# EasyEDA Pro project easyeda.epro

# Schematic Schematic1
Board Name: Board1; Create Date: 2025-08-13; Page Name: P1; Project Name: bop - audio over bluetooth; Schematic Name: Schematic1; Update Date: 2025-08-18; Company: EasyEDA.com; Page Size: A4; Version: V1.0
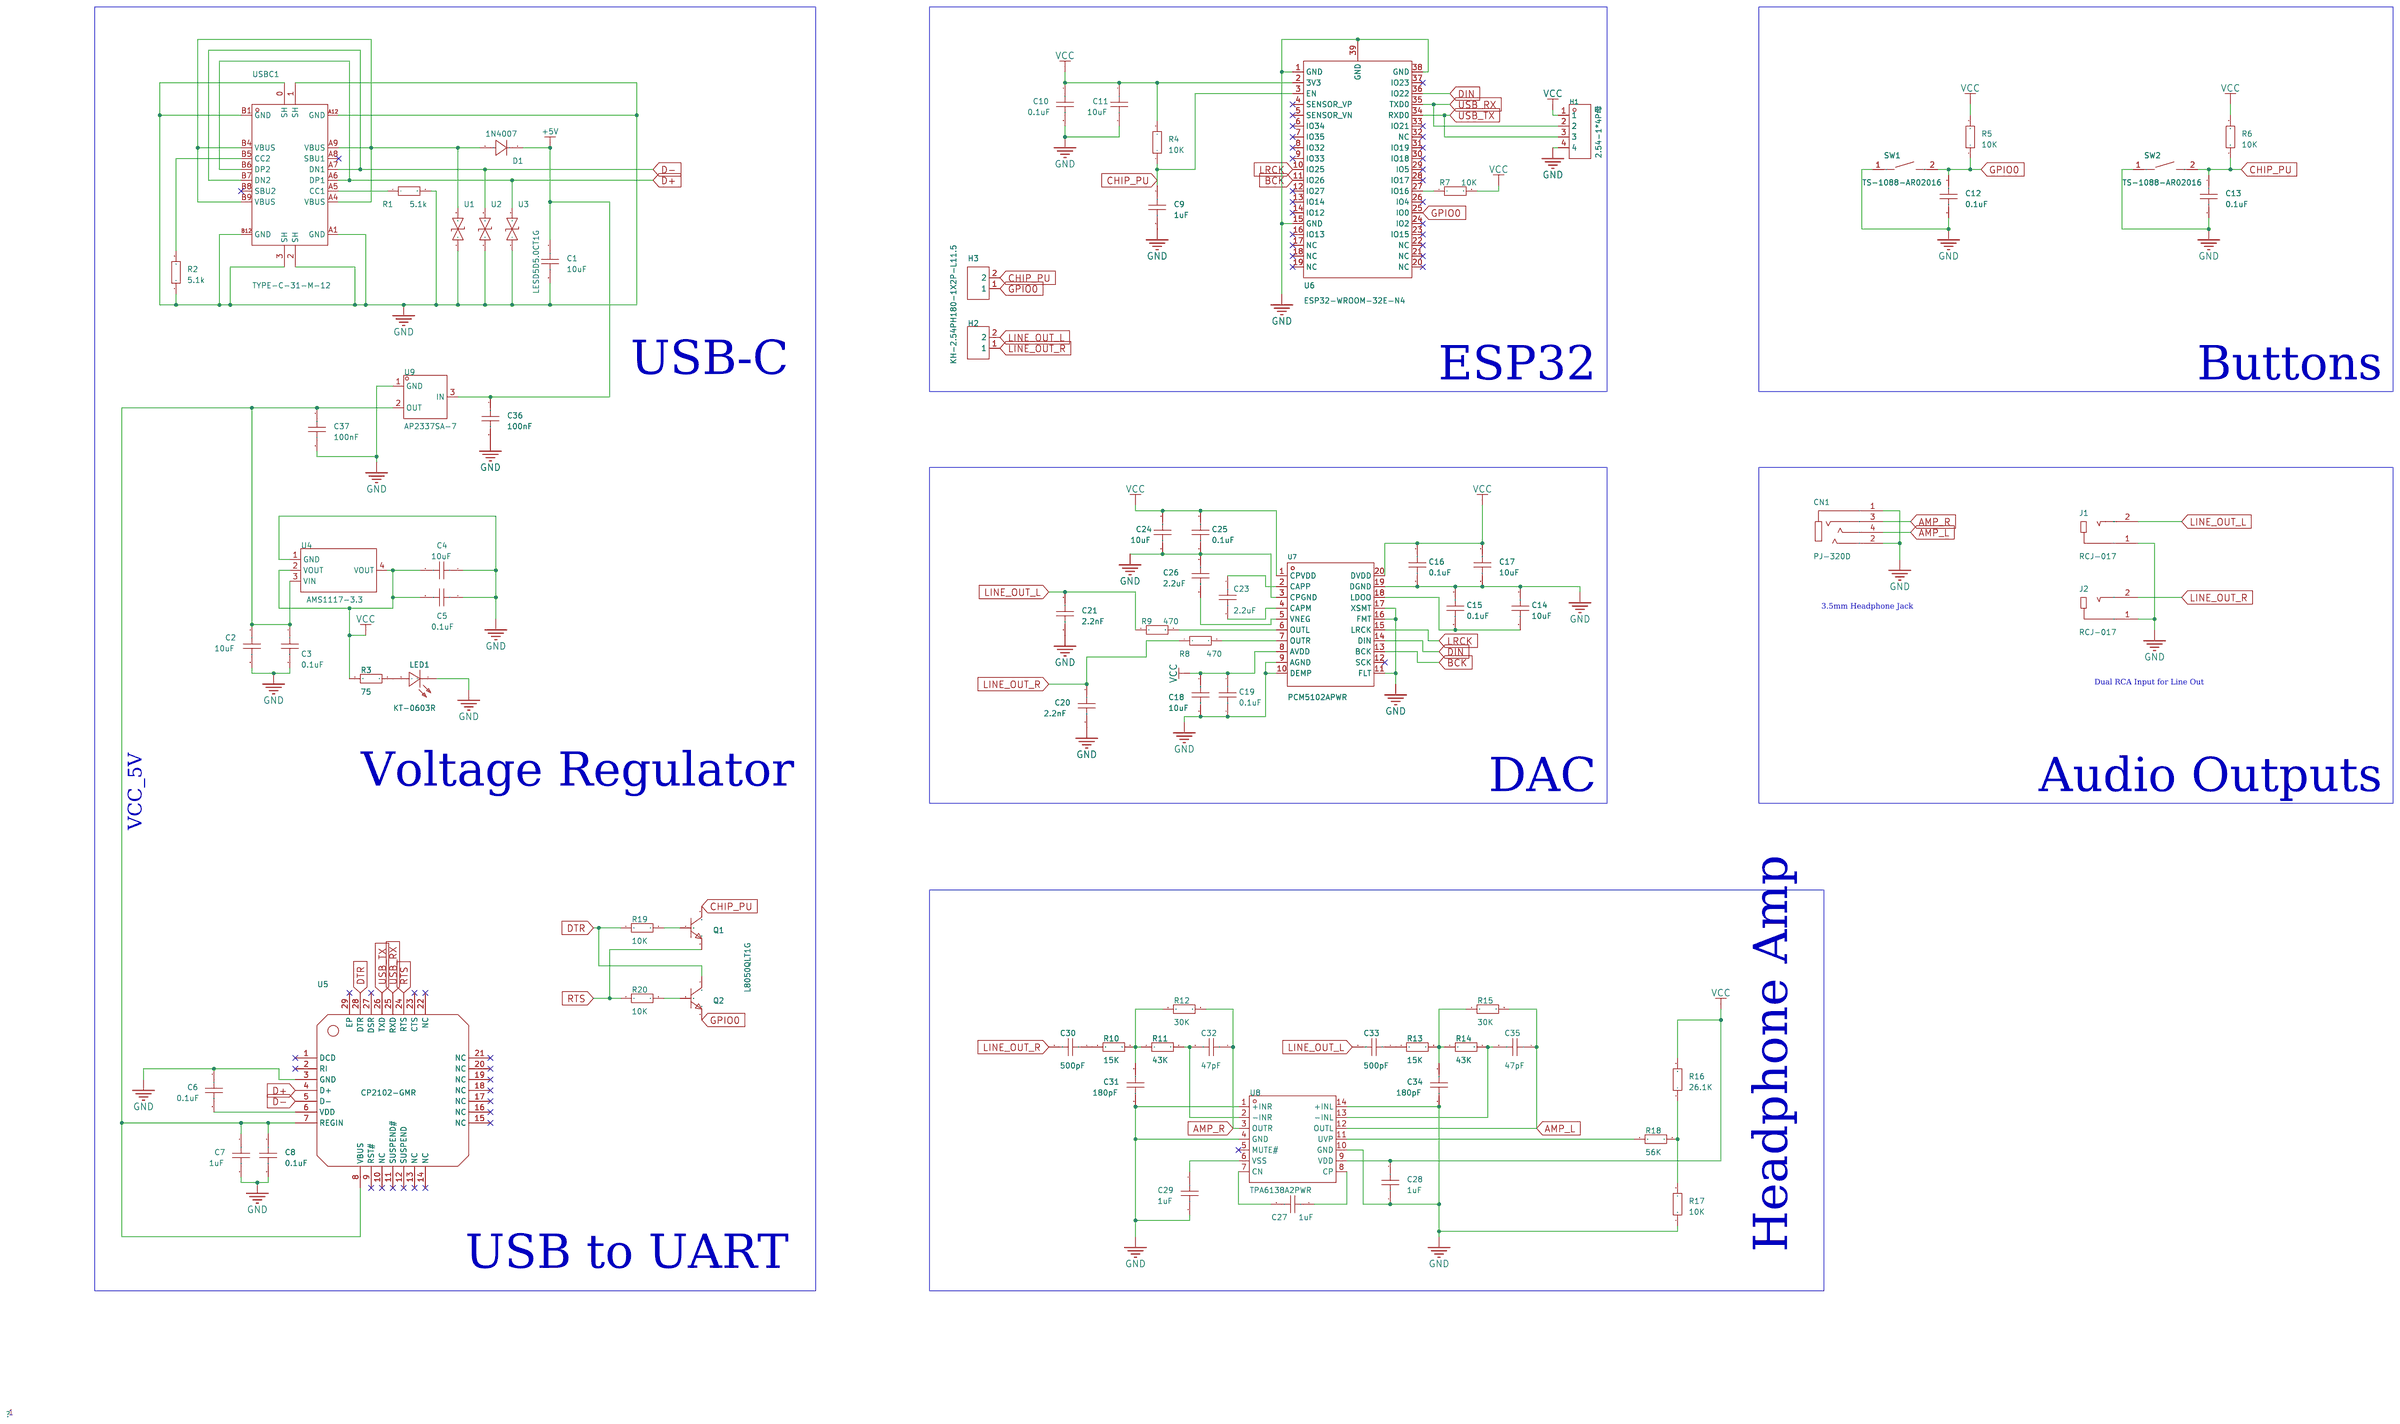
[diagram p0: schematic sheet]

## Parts
C1  10uF  [C0603]
C2  10uF  [C0603]
C3  0.1uF  [C0603]
C4  10uF  [C0603]
C5  0.1uF  [C0603]
C6  0.1uF  [C0603]
C7  1uF  [C0603]
C8  0.1uF  [C0603]
C9  1uF  [C0603]
C10  0.1uF  [C0603]
C11  10uF  [C0603]
C12  0.1uF  [C0603]
C13  0.1uF  [C0603]
C14  10uF  [C0603]
C15  0.1uF  [C0603]
C16  0.1uF  [C0603]
C17  10uF  [C0603]
C18  10uF  [C0603]
C19  0.1uF  [C0603]
C20  2.2nF  [C0603]
C21  2.2nF  [C0603]
C23  2.2uF  [C0603]
C24  10uF  [C0603]
C25  0.1uF  [C0603]
C26  2.2uF  [C0603]
C27  1uF  [C0603]
C28  1uF  [C0603]
C29  1uF  [C0603]
C30  500pF  [C0603]
C31  180pF  [C0603]
C32  47pF  [C0603]
C33  500pF  [C0603]
C34  180pF  [C0603]
C35  47pF  [C0603]
C36  100nF  [C0603]
C37  100nF  [C0603]
CN1  PJ-320D  [AUDIO-SMD_PJ-320D]
D1  1N4007  [SMA_L4.3-W2.5-LS5.0-RD]
H1  2.54-1*4P母  [HDR-TH_4P-P2.54-V-F]
H2  KH-2.54PH180-1X2P-L11.5  [HDR-TH_2P-P2.54-V-M]
H3  KH-2.54PH180-1X2P-L11.5  [HDR-TH_2P-P2.54-V-M]
J1  RCJ-017  [CONN-TH_RCJ-013]
J2  RCJ-017  [CONN-TH_RCJ-013]
LED1  KT-0603R  [LED0603-RD]
Q1  L8050QLT1G  [SOT-23-3_L2.9-W1.3-P1.90-LS2.4-BR]
Q2  L8050QLT1G  [SOT-23-3_L2.9-W1.3-P1.90-LS2.4-BR]
R1  5.1k  [R0603]
R2  5.1k  [R0603]
R3  75  [R0603]
R4  10K  [R0603]
R5  10K  [R0603]
R6  10K  [R0603]
R7  10K  [R0603]
R8  470  [R0603]
R9  470  [R0603]
R10  15K  [R0603]
R11  43K  [R0603]
R12  30K  [R0603]
R13  15K  [R0603]
R14  43K  [R0603]
R15  30K  [R0603]
R16  26.1K  [R0603]
R17  10K  [R0603]
R18  56K  [R0603]
R19  10K  [R0603]
R20  10K  [R0603]
SW1  TS-1088-AR02016  [SW-SMD_L3.9-W3.0-P4.45]
SW2  TS-1088-AR02016  [SW-SMD_L3.9-W3.0-P4.45]
U1  LESD5D5.0CT1G  [SOD-523_L1.2-W0.8-LS1.6-BI]
U2  LESD5D5.0CT1G  [SOD-523_L1.2-W0.8-LS1.6-BI]
U3  LESD5D5.0CT1G  [SOD-523_L1.2-W0.8-LS1.6-BI]
U4  AMS1117-3.3  [SOT-223-3_L6.5-W3.4-P2.30-LS7.0-BR]
U5  CP2102-GMR  [WQFN-28_L5.0-W5.0-P0.50-BL-EP3.2]
U6  ESP32-WROOM-32E-N4  [WIFI-SMD_ESP32-WROOM-32E]
U7  PCM5102APWR  [TSSOP-20_L6.5-W4.4-P0.65-LS6.4-BL]
U8  TPA6138A2PWR  [TSSOP-14_L5.0-W4.4-P0.65-LS6.4-BL]
U9  AP2337SA-7  [SOT-23-3_L2.9-W1.3-P1.90-LS2.4-BR]
USBC1  TYPE-C-31-M-12  [USB-C_SMD-TYPE-C-31-M-12]

## Library data of the parts
C1-C21 C23-C37 = CAP_0603: Supplier Footprint: 0603
CN1 = PJ-320D_C521460: Connector Type:3.5mm耳机座 Current Rating (Max):1A Voltage Rating (Max):30V Operating Temperature Range:- Operating Temperature Range:-; LCSC Part Name: 3.5mm耳机座; Supplier Part: C521460; Manufacturer: USAKRO(美韩); Supplier Footprint: SMD; JLCPCB Part Class: Extended Part; Datasheet: https://atta.szlcsc.com/upload/public/pdf/source/20200424/C521460_2B00C929BFB12DD9A87BCC02E8D00E32.pdf; Supplier: LCSC; Connector Type: 3.5mm耳机座; Current Rating (Max): 1A; Voltage Rating (Max): 30V
D1 = 1N4007_C727081: Diode Configuration:Independent Voltage - Forward(Vf@If):1.1V@1A Voltage - DC Reverse(Vr):1kV Current - Rectified:1A Reverse Leakage Current (Ir):5uA; Supplier Part: C727081; Manufacturer: TWGMC(台湾迪嘉); Supplier Footprint: SMA(DO-214AC); JLCPCB Part Class: Extended Part; Datasheet: https://item.szlcsc.com/datasheet/1N4007/774186.html; Supplier: LCSC; Diode Configuration: Independent; Voltage - Forward(Vf@If): 1.1V@1A; Voltage - DC Reverse(Vr): 1kV; Current - Rectified: 1A; Reverse Leakage Current (Ir): 5uA
H1 = 2.54-1*4P母: Holes Structure:1x4P Pitch:2.54mm Row Spacing:- Circular Hole / Square Hole:Square Holes Mounting Type:Straight Number of Rows:Plugin Number of Holes:4P Current Rating (Max):3A Voltage Rating (Max):- Holes Direction:Top Insulation Height:- Contact Materia; LCSC Part Name: 间距:2.54mm 1x4P 直插; Supplier Part: C2718488; Manufacturer: BOOMELE(博穆精密); Supplier Footprint: 插件,P=2.54mm; JLCPCB Part Class: Extended Part; Datasheet: https://atta.szlcsc.com/upload/public/pdf/source/20210301/C2718488_F4427B881E42CAA8DDB0B1C12B3A522C.pdf; Supplier: LCSC; Holes Structure: 1x4P; Pitch: 2.54mm; Circular Hole / Square Hole: Square Holes; Mounting Type: Straight; Number of Rows: Plugin; Number of Holes: 4P; Current Rating (Max): 3A; Holes Direction: Top; Contact Material: bronze; Operating Temperature Range: -40℃~+105℃
H2 H3 = KH-2.54PH180-1X2P-L11.5: Pin Structure:1x2P Pitch:2.54mm Row Spacing:- Circluar Pins/Square Pins:Policy Mounting Type:Straight Number of Rows:Single Row Number of Pins:2P Current Rating:3A Voltage Rating (Max):- Length of Mating Pin:6mm Insulation Height:2.5mm Length of End Conne; LCSC Part Name: 1x2P 间距:2.54mm 方针 直插; Supplier Part: C2905434; Manufacturer: kinghelm(金航标); Supplier Footprint: 插件,P=2.54mm; JLCPCB Part Class: Extended Part; Datasheet: https://atta.szlcsc.com/upload/public/pdf/source/20211019/75EAF9E0823F75B5BB441C07BAE9F5E6.pdf; Supplier: LCSC; Pin Structure: 1x2P; Pitch: 2.54mm; Circluar Pins/Square Pins: Policy; Mounting Type: Straight; Number of Rows: Single Row; Number of Pins: 2P; Current Rating: 3A; Length of Mating Pin: 6mm; Insulation Height: 2.5mm; Length of End Connection Pin: 3mm; Operating Temperature: -40℃~+105℃; Color: Black
J1 J2 = RCJ-017: Supplier Part: C22359757; Manufacturer: CUI; JLCPCB Part Class: Extended Part; Datasheet: https://item.szlcsc.com/datasheet/RCJ-017/23802230.html; Supplier: LCSC
LED1 = KT-0603R: Emitted Color:Red Power Dissipation:- Forward Current:- Dominant Wavelength:- Dominant Wavelength:- Peak Wavelength:- Diode Configuration:- Lens Color:- Color Temperature:- Color Temperature:- Viewing Angle:- Mounting Sytle:- Operating Temperature:-40℃~+8; LCSC Part Name: 0603 红灯 高亮; Supplier Part: C2286; Manufacturer: KENTO; Supplier Footprint: 0603; JLCPCB Part Class: Basic Part; Datasheet: https://atta.szlcsc.com/upload/public/pdf/source/20160616/1466072038404.pdf; Supplier: LCSC; Emitted Color: Red; Operating Temperature: -40℃~+85℃
Q1 Q2 = L8050QLT1G: Transistor Type: Collector Current (Ic): Collector-Emitter Breakdown Voltage (Vceo): Power Dissipation (Pd): DC Current Gain (hFE@Ic,Vce):100@100mA,1V DC Current Gain (hFE@Ic,Vce):100@100mA,1V Collector Cut-Off Current (Icbo):150nA Collector-Emitter Satur; LCSC Part Name: NPN 电流:800mA 耐压:25V; Supplier Part: C49581; Manufacturer: LRC(乐山无线电); Supplier Footprint: SOT-23; JLCPCB Part Class: Extended Part; Datasheet: https://atta.szlcsc.com/upload/public/pdf/source/20150518/1457707314424.pdf; Supplier: LCSC; DC Current Gain (hFE@Ic,Vce): 100@100mA,1V; Collector Cut-Off Current (Icbo): 150nA; Collector-Emitter Saturation Voltage (VCE(sat)@Ic,Ib): 500mV@800mA,80mA; Operating Temperature: -55℃~+150℃
R1-R20 = Res_0603: Supplier Footprint: 0603
SW1 SW2 = TS-1088-AR02016: Circuit:SPST Actuator Style:Round Button Operating Force:160gf Mounting Style:Brick nogging Switch Length:4mm Switch Width:3mm Switch Height:2mm Strike Gundam:不带 Contact Current:50mA Voltage Rating (DC):12V Insulation Resistance:100MΩ Actuator/Cap Color:B; LCSC Part Name: 4*3*2mm 立贴 轻触开关; Supplier Part: C720477; Manufacturer: XUNPU(讯普); Supplier Footprint: SMD; JLCPCB Part Class: Basic Part; Datasheet: https://atta.szlcsc.com/upload/public/pdf/source/20200810/C720475_60D09DD6C54279ADDB2DC25100F1CC11.pdf; Supplier: LCSC; Circuit: SPST; Actuator Style: Round Button; Operating Force: 160gf; Mounting Style: Brick nogging; Switch Length: 4mm; Switch Width: 3mm; Switch Height: 2mm; Strike Gundam: 不带; Contact Current: 50mA; Voltage Rating (DC): 12V; Insulation Resistance: 100MΩ; Actuator/Cap Color: Black; Pin Style: SMDSplicing; Mechanical Life: 10万次; Operating Temperature: -30℃~+80℃
U1-U3 = LESD5D5.0CT1G_C5246195: Supplier Part: C5246195; Manufacturer: Leiditech(雷卯电子); Supplier Footprint: SOD-523; JLCPCB Part Class: Extended Part; Datasheet: https://atta.szlcsc.com/upload/public/pdf/source/20221108/1C42B36F7D16189BC2911DA9C8277455.pdf; Supplier: LCSC
U4 = AMS1117-3.3_C6186: Output Type:Fixed Voltage - Supply:16V Output Voltage:3.3V Output Voltage:3.3V Output Current:1A Power Supply Rejection Ratio (PSRR):72dB@(120Hz) Voltage Dropout:1.1V@(800mA) standby current:5mA Noise:- Features:Over Current Protection；Over Temperature Pr; LCSC Part Name: 输出3.3V 1A; Supplier Part: C6186; Manufacturer: AMS; Supplier Footprint: SOT-223; JLCPCB Part Class: Basic Part; Datasheet: https://item.szlcsc.com/datasheet/AMS1117-3.3/6652.html; Supplier: LCSC; Output Type: Fixed; Voltage - Supply: 16V; Output Voltage: 3.3V; Output Current: 1A; Power Supply Rejection Ratio (PSRR): 72dB@(120Hz); Voltage Dropout: 1.1V@(800mA); standby current: 5mA; Features: Over Current Protection；Over Temperature Protection; Operating Temperature: -40℃~+125℃; Output Configuration: Positive; Number of Outputs: 1
U5 = CP2102-GMR: Applications Function:Transceiver Protocol: Number of Channels:- Supply Voltage:3V~3.6V Supply Voltage:3V~3.6V Data Rate:12Mbps Operating Temperature:- Operating Temperature:-; LCSC Part Name: 单芯片USB转UART桥接器; Supplier Part: C6568; Manufacturer: SKYWORKS/SILICON LABS(芯科); Supplier Footprint: WQFN-28-EP(5x5); JLCPCB Part Class: Extended Part; Datasheet: https://atta.szlcsc.com/upload/public/pdf/source/20170103/1483439882795.pdf; Supplier: LCSC; Applications Function: Transceiver; Supply Voltage: 3V~3.6V; Data Rate: 12Mbps
U6 = ESP32-WROOM-32E-N4: LCSC Part Name: 通用型Wi-Fi+BT+BLE MCU模组; Supplier Part: C701341; Manufacturer: ESPRESSIF(乐鑫); Supplier Footprint: SMD,18x25.5mm; JLCPCB Part Class: Extended Part; Datasheet: https://atta.szlcsc.com/upload/public/pdf/source/20241030/447B1C85FFE3FB0A37F75624F2C6635F.pdf; Supplier: LCSC
U7 = PCM5102APWR: Interface Type:PCM Supply Voltage:1.65V~3.46V Supply Voltage:1.65V~3.46V Number of Channels:2 Resolution:24；16；32 Operating Temperature:-25℃~+85℃ Operating Temperature:-25℃~+85℃; Supplier Part: C107671; Manufacturer: TI(德州仪器); Supplier Footprint: TSSOP-20; JLCPCB Part Class: Extended Part; Datasheet: https://www.ti.com/cn/lit/gpn/pcm5102a; Supplier: LCSC; Interface Type: PCM; Supply Voltage: 1.65V~3.46V; Number of Channels: 2; Resolution: 24；16；32; Operating Temperature: -25℃~+85℃
U8 = TPA6138A2PWR: Class:Class AB Speaker Channels:2-Channel Output Power:40mWx2@32Ω Voltage - Supply:3V~3.6V Voltage - Supply:3V~3.6V Total Harmonic Distortion + Noise (THD+N):0.01% Quiescent Current:14mA Operating Temperature:-40℃~+85℃ Operating Temperature:-40℃~+85℃ Sign; LCSC Part Name: 具有可调增益的立体声耳机驱动器; Supplier Part: C183097; Manufacturer: TI(德州仪器); Supplier Footprint: TSSOP-14; JLCPCB Part Class: Extended Part; Datasheet: https://www.ti.com/cn/lit/gpn/tpa6138a2; Supplier: LCSC; Class: Class AB; Speaker Channels: 2-Channel; Output Power: 40mWx2@32Ω; Voltage - Supply: 3V~3.6V; Total Harmonic Distortion + Noise (THD+N): 0.01%; Quiescent Current: 14mA; Operating Temperature: -40℃~+85℃; Signal-to-Noise Ratio: 96dB; Input Type: Differential; Power Supply Rejection Ratio (PSRR): 80dB; Number of Inputs: 2对差分输入
U9 = AP2337SA-7: Type:Load Switch Number of Channels:1 Control Input Logic:- Maximum Continuous Current:1A Voltage - Supply:2.7V~5.5V Voltage - Supply:2.7V~5.5V RDS(on):110mΩ Operating Temperature	-:-40℃~+85℃ Operating Temperature	-:-40℃~+85℃; Supplier Part: C150497; Manufacturer: DIODES(美台); Supplier Footprint: SOT-23; JLCPCB Part Class: Extended Part; Datasheet: https://item.szlcsc.com/datasheet/AP2337SA-7/161835.html; Supplier: LCSC; Type: Load Switch; Number of Channels: 1; Maximum Continuous Current: 1A; Voltage - Supply: 2.7V~5.5V; RDS(on): 110mΩ; Operating Temperature	-: -40℃~+85℃
USBC1 = TYPE-C-31-M-12: Connector Type:Type-C Standard:- Gender:Female Mounting Style:- Number of Contacts:16P Number of Ports:1 Current Rating - Power (Max):5A Operating Temperature Range:- Operating Temperature Range:-; LCSC Part Name: Type-C 母; Supplier Part: C165948; Manufacturer: 韩国韩荣; Supplier Footprint: SMD; JLCPCB Part Class: Extended Part; Datasheet: https://atta.szlcsc.com/upload/public/pdf/source/20220525/466408E853115E789EDB0DDC29077C05.pdf; Supplier: LCSC; Connector Type: Type-C; Gender: Female; Number of Contacts: 16P; Number of Ports: 1; Current Rating - Power (Max): 5A

## Nets
+5V: C1.1 C36.1 D1.1(K) U9.3(IN)
GND: C1.2 C2.2 C3.2 C4.1 C5.1 C6.1 C7.2 C8.2 C9.2 C10.2 C11.2 C12.2 C13.2 C14.1 C15.1 C16.2 C17.2 C18.2 C19.2 C20.2 C21.2 C24.2 C25.2 C26.1 C28.2 C29.2 C31.2 C34.2 C36.2 C37.2 CN1.1 CN1.2 H1.4 J1.1 J2.1 LED1.1(K) R1.2 R2.1 R17.1 SW1.1 SW2.1 U1.1 U2.1 U3.1 U4.1(GND) U5.3(GND) U6.1(GND) U6.15(GND) U6.38(GND) U6.39(GND) U7.3(CPGND) U7.9(AGND) U7.10(DEMP) U7.11(FLT) U7.16(FMT) U7.17(XSMT) U7.19(DGND) U8.1(+INR) U8.4(GND) U8.10(GND) U8.14(+INL) U9.1(GND) USBC1.0(SH) USBC1.1(SH) USBC1.2(SH) USBC1.3(SH) USBC1.A1(GND) USBC1.A12(GND) USBC1.B1(GND) USBC1.B12(GND)
VCC: C4.2 C5.2 C10.1 C11.1 C16.1 C17.1 C18.1 C19.1 C24.1 C25.1 C28.1 H1.1 R3.2 R4.2 R5.2 R6.2 R7.2 R16.2 U4.2(VOUT) U4.4(VOUT) U6.2(3V3) U7.1(CPVDD) U7.8(AVDD) U7.20(DVDD) U8.9(VDD)
AMP_L: C35.1 CN1.4 R15.2 U8.12(OUTL)
AMP_R: C32.1 CN1.3 R12.2 U8.3(OUTR)
BCK: U6.11(IO26) U7.13(BCK)
CHIP_PU: C9.1 C13.1 H3.2 Q1.3(C) R4.1 R6.1 SW2.2 U6.3(EN)
D+: U3.2 U5.4(D+) USBC1.A6(DP1) USBC1.B6(DP2)
D-: U2.2 U5.5(D-) USBC1.A7(DN1) USBC1.B7(DN2)
DIN: U6.36(IO22) U7.14(DIN)
DTR: Q2.3(C) R19.1 U5.28(DTR)
GPIO0: C12.1 H3.1 Q2.2(E) R5.1 SW1.2 U6.25(IO0)
LINE_OUT_L: C21.1 C33.2 H2.2 J1.2 R9.1
LINE_OUT_R: C20.1 C30.2 H2.1 J2.2 R8.1
LRCK: U6.10(IO25) U7.15(LRCK)
RTS: Q1.2(E) R20.1 U5.24(RTS)
USB_RX: H1.2 U5.25(RXD) U6.35(TXD0)
USB_TX: H1.3 U5.26(TXD) U6.34(RXD0)
$1N698: R1.1 USBC1.A5(CC1)
$1N818: R2.2 USBC1.B5(CC2)
$1N1017: D1.2(A) U1.2 USBC1.A4(VBUS) USBC1.A9(VBUS) USBC1.B4(VBUS) USBC1.B9(VBUS)
$1N2185: LED1.2(A) R3.1
$1N2543: C6.2 U5.6(VDD)
$1N4373: R7.1 U6.27(IO16)
$1N4719: C14.2 C15.2 U7.18(LDOO)
$1N5077: R8.2 U7.7(OUTR)
$1N5228: R9.2 U7.6(OUTL)
$1N5429: C23.2 U7.4(CAPM)
$1N5435: C23.1 U7.2(CAPP)
$1N5672: C26.2 U7.5(VNEG)
$1N6006: C27.2 U8.7(CN)
$1N6011: C27.1 U8.8(CP)
$1N6223: C29.1 U8.6(VSS)
$1N6630: C30.1 R10.1
$1N6710: C31.1 R10.2 R11.1 R12.1
$1N6768: C32.2 R11.2 U8.2(-INR)
$1N7245: C33.1 R13.1
$1N7247: C34.1 R13.2 R14.1 R15.1
$1N7639: R18.1 U8.11(UVP)
$1N7645: R16.1 R17.2 R18.2
$1N7658: C35.2 R14.2 U8.13(-INL)
$1N19592: C2.1 C3.1 C7.1 C8.1 C37.1 U4.3(VIN) U5.7(REGIN) U5.8(VBUS) U9.2(OUT)
$1N20296: Q1.1(B) R19.2
$1N20339: Q2.1(B) R20.2

Not connected (* = marked no-connect by the designer): U5 1(DCD)* 2(RI)* 9(RST#)* 10(NC)* 11(SUSPEND#)* 12(SUSPEND)* 13(NC)* 14(NC)* 15(NC)* 16(NC)* 17(NC)* 18(NC)* 19(NC)* 20(NC)* 21(NC)* 22(NC)* 23(CTS)* 27(DSR)* 29(EP)*; U6 4(SENSOR_VP)* 5(SENSOR_VN)* 6(IO34)* 7(IO35)* 8(IO32)* 9(IO33)* 12(IO27)* 13(IO14)* 14(IO12)* 16(IO13)* 17(NC)* 18(NC)* 19(NC)* 20(NC)* 21(NC)* 22(NC)* 23(IO15)* 24(IO2)* 26(IO4)* 28(IO17)* 29(IO5)* 30(IO18)* 31(IO19)* 32(NC)* 33(IO21)* 37(IO23)*; U7 12(SCK)*; U8 5(MUTE#)*; USBC1 A8(SBU1)* B8(SBU2)*

## Notes on the sheet
- USB-C
- ESP32
- Buttons
- 3.5mm Headphone Jack
- Dual RCA Input for Line Out
- VCC_5V
- Voltage Regulator
- DAC
- Audio Outputs
- Headphone Amp
- USB to UART

# Board PCB1
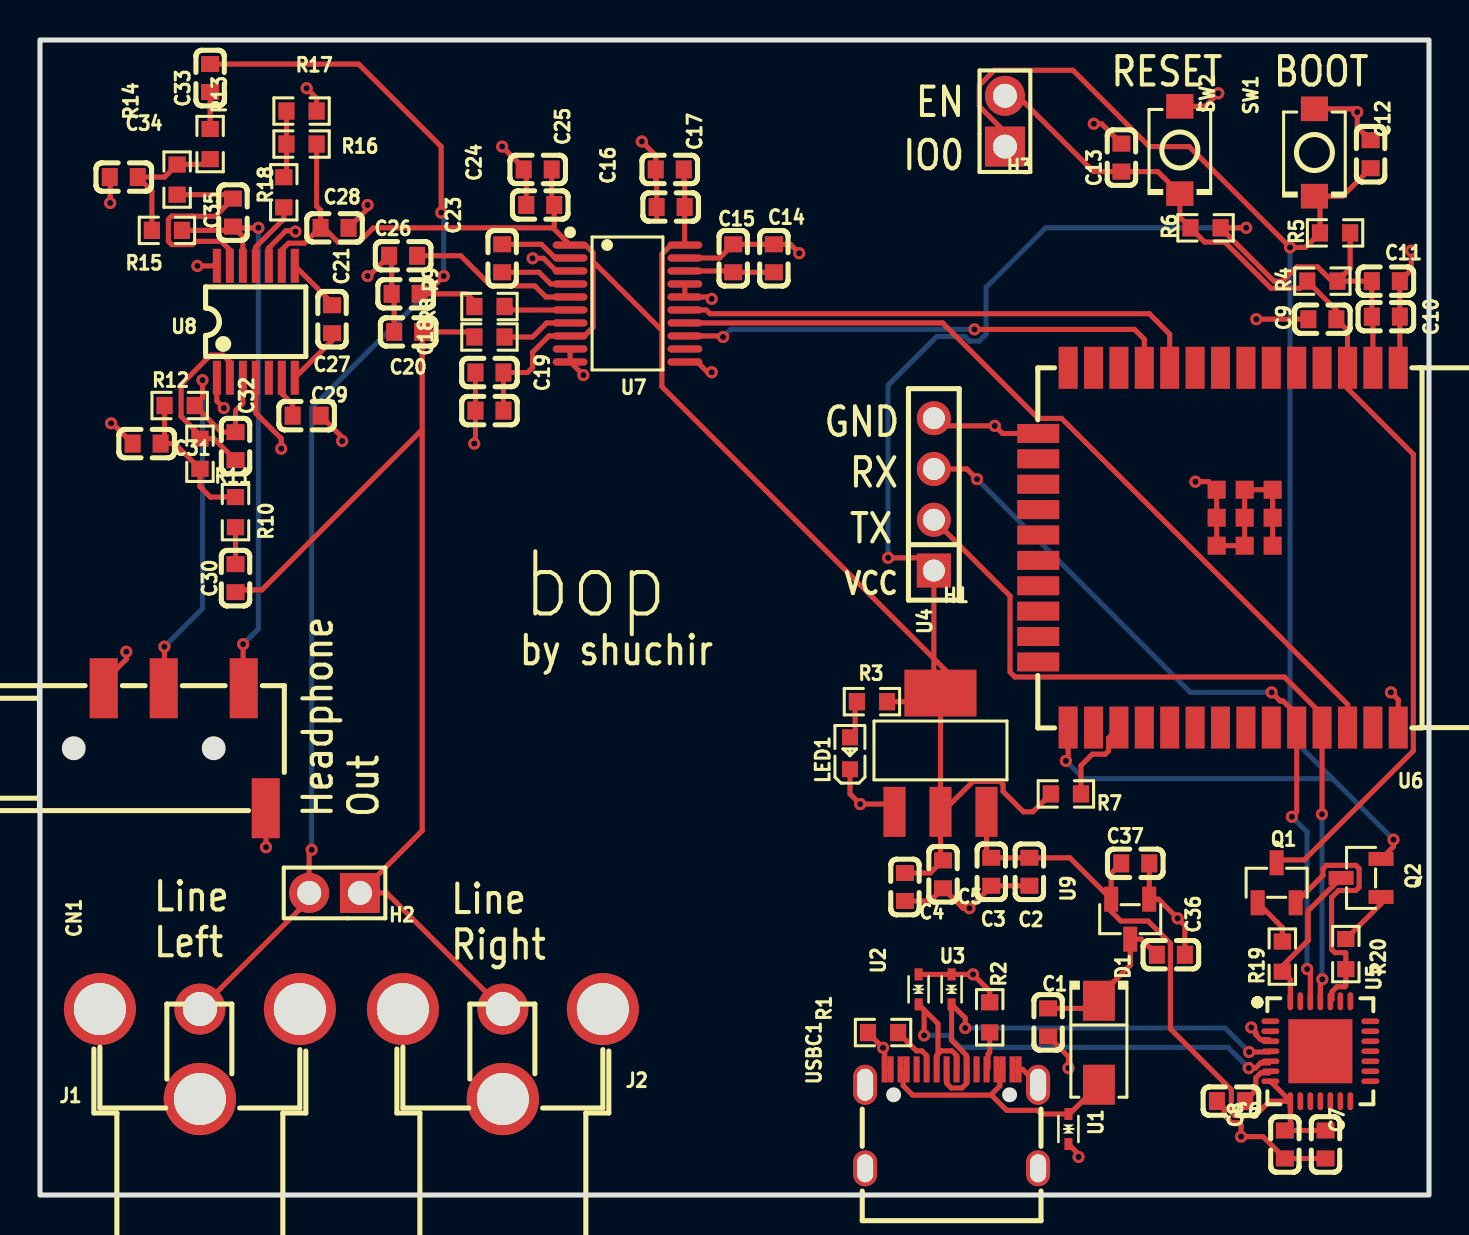
[diagram p1: board, top side]
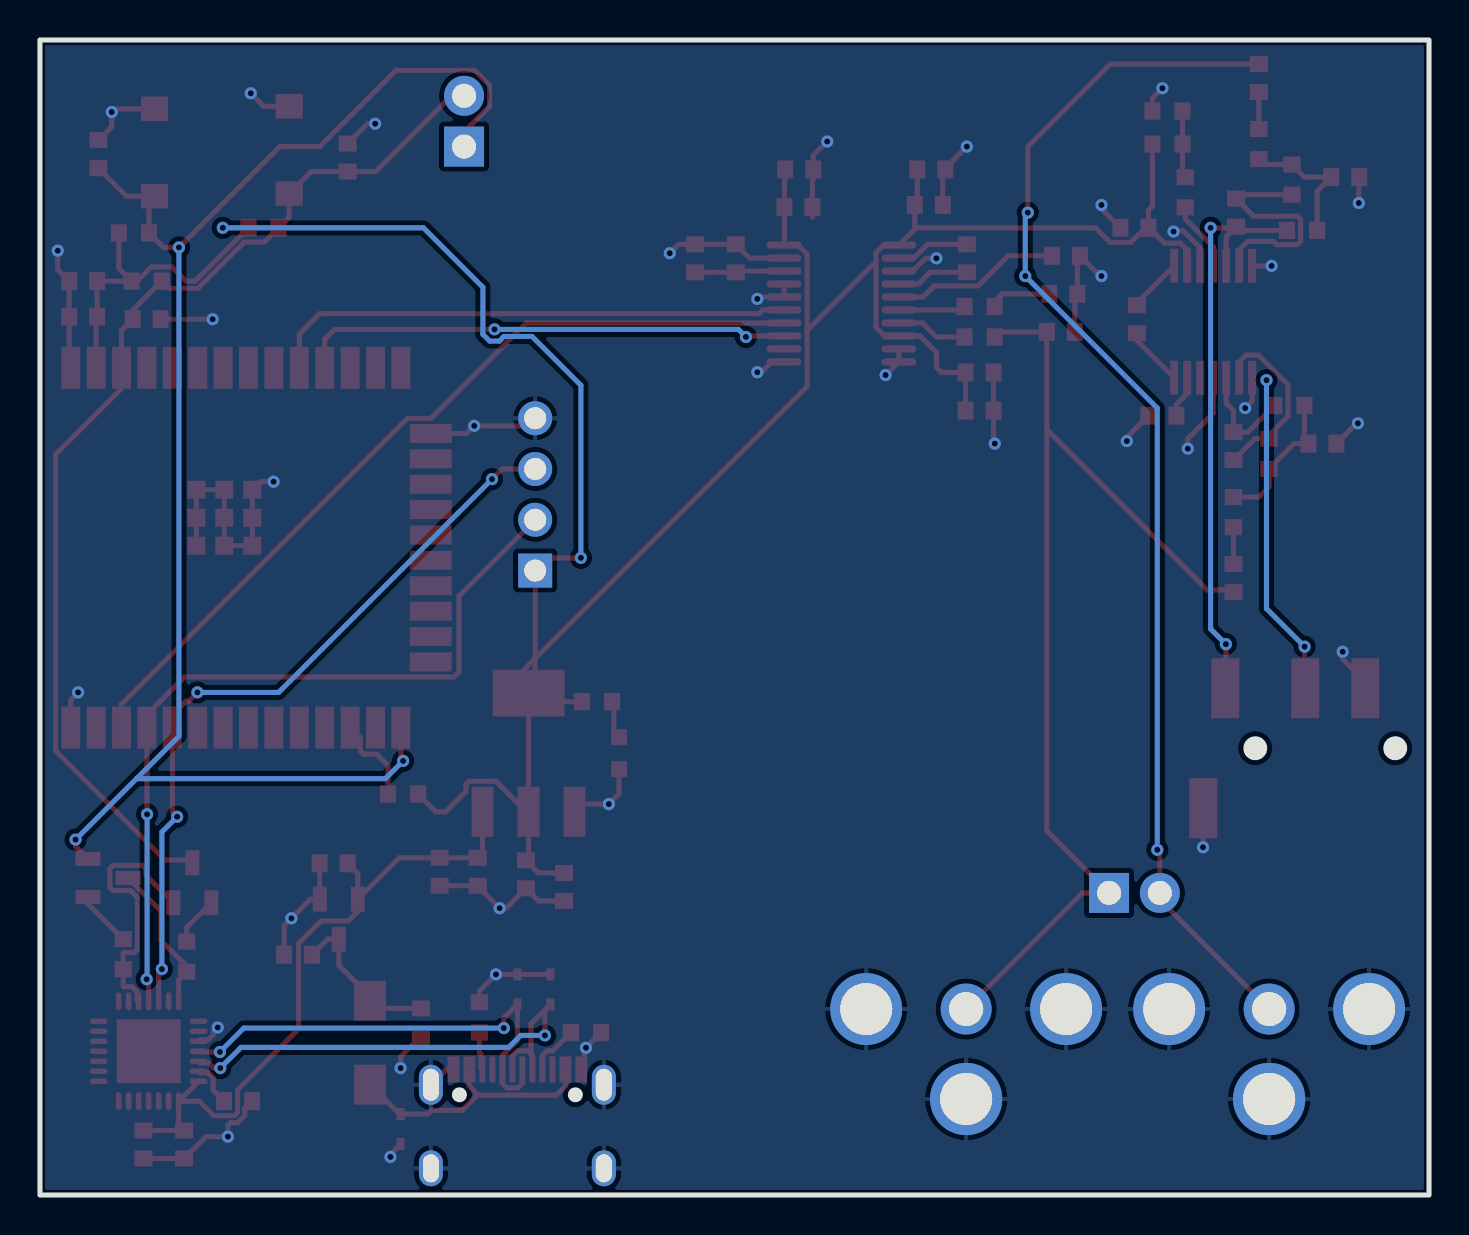
[diagram p2: board, bottom side, seen from below]

Outline 69.47 x 57.79 mm; copper layers: Top Layer, Bottom Layer. Coordinates in mm from the lower left corner of the outline.
Outline path: rectangle 0,57.79 69.47,0
Stack: Top Layer 0.035mm / Dielectric1 1.51mm FR4 er 4.5 / Bottom Layer 0.035mm

## Design rules (mm)
template: JLCPCB Capability(Two Layers Board)
spacing copperThickness1oz (default): track to track 0.102, other pairs 0.152 to 0.3
spacing copperThickness2oz: track to track 0.203, other pairs 0.152 to 0.3
track width copperThickness1oz (default): min 0.127, default 0.254, max 2.54
track width copperThickness2oz: min 0.203, default 0.254, max 2.54
differential pair differentialPair (default): width min 0.127, default 0.254, max 2.54; gap min 0.152, default 0.152
via viaSize (default): diameter min 0.5, default 0.61, max 10; hole min 0.3, default 0.305, max 6.3

## Placement (name value [footprint] x y rotation side)
C1  10uF  [C0603]  50.42 8.64 270 top
C2  10uF  [C0603]  49.48 16.17 270 top
C3  0.1uF  [C0603]  47.58 16.17 270 top
C4  10uF  [C0603]  43.26 15.41 90 top
C5  0.1uF  [C0603]  45.16 16.05 90 top
C6  0.1uF  [C0603]  59.56 4.7 0 top
C7  1uF  [C0603]  64.29 2.53 270 top
C8  0.1uF  [C0603]  62.26 2.53 270 top
C9  1uF  [C0603]  64.14 43.82 180 top
C10  0.1uF  [C0603]  67.31 43.94 0 top
C11  10uF  [C0603]  67.31 45.72 0 top
C12  0.1uF  [C0603]  66.55 52.07 90 top
C13  0.1uF  [C0603]  54.09 51.9 90 top
C14  10uF  [C0603]  36.7 46.86 270 top
C15  0.1uF  [C0603]  34.67 46.86 270 top
C16  0.1uF  [C0603]  31.54 49.43 180 top
C17  10uF  [C0603]  31.5 51.31 180 top
C18  10uF  [C0603]  22.48 41.15 180 top
C19  0.1uF  [C0603]  22.48 39.24 180 top
C20  2.2nF  [C0603]  18.42 43.18 180 top
C21  2.2nF  [C0603]  18.29 45.09 180 top
C23  2.2uF  [C0603]  23.11 46.86 270 top
C24  10uF  [C0603]  25.02 49.53 180 top
C25  0.1uF  [C0603]  24.89 51.31 180 top
C26  2.2uF  [C0603]  18.16 46.99 0 top
C27  1uF  [C0603]  14.61 43.82 270 top
C28  1uF  [C0603]  14.73 48.39 0 top
C29  1uF  [C0603]  13.34 38.99 0 top
C30  500pF  [C0603]  9.78 30.86 270 top
C31  180pF  [C0603]  5.33 37.59 180 top
C32  47pF  [C0603]  9.78 37.47 270 top
C33  500pF  [C0603]  8.51 55.88 90 top
C34  180pF  [C0603]  4.19 50.93 180 top
C35  47pF  [C0603]  9.65 49.15 90 top
C36  100nF  [C0603]  56.56 12.02 0 top
C37  100nF  [C0603]  54.78 16.59 0 top
CN1  PJ-320D  [AUDIO-SMD_PJ-320D]  7.24 22.35 90 top
D1  1N4007  [SMA_L4.3-W2.5-LS5.0-RD]  52.96 7.62 270 top
H1  2.54-1*4P母  [HDR-TH_4P-P2.54-V-F]  44.7 35.05 90 top
H2  KH-2.54PH180-1X2P-L11.5  [HDR-TH_2P-P2.54-V-M]  14.73 15.11 180 top
H3  KH-2.54PH180-1X2P-L11.5  [HDR-TH_2P-P2.54-V-M]  48.26 53.72 90 top
J1  RCJ-017  [CONN-TH_RCJ-013]  8 7.05 90 top
J2  RCJ-017  [CONN-TH_RCJ-013]  23.15 7.05 90 top
LED1  KT-0603R  [LED0603-RD]  40.51 22.1 90 top
Q1  L8050QLT1G  [SOT-23-3_L2.9-W1.3-P1.90-LS2.4-BR]  61.85 15.62 270 top
Q2  L8050QLT1G  [SOT-23-3_L2.9-W1.3-P1.90-LS2.4-BR]  66.07 15.86 0 top
R1  5.1k  [R0603]  42.16 8.13 180 top
R2  5.1k  [R0603]  47.5 8.89 270 top
R3  75  [R0603]  41.61 24.68 0 top
R4  10K  [R0603]  64.14 45.72 0 top
R5  10K  [R0603]  64.77 48.13 0 top
R6  10K  [R0603]  58.29 48.39 0 top
R7  10K  [R0603]  51.31 20.07 180 top
R8  470  [R0603]  22.48 42.93 0 top
R9  470  [R0603]  22.48 44.45 0 top
R10  15K  [R0603]  9.78 34.16 90 top
R11  43K  [R0603]  8 37.08 90 top
R12  30K  [R0603]  6.98 39.5 0 top
R13  15K  [R0603]  8.51 52.58 270 top
R14  43K  [R0603]  6.86 50.8 270 top
R15  30K  [R0603]  6.35 48.26 0 top
R16  26.1K  [R0603]  13.08 52.58 0 top
R17  10K  [R0603]  13.08 54.23 180 top
R18  56K  [R0603]  12.19 50.17 90 top
R19  10K  [R0603]  62.13 11.93 90 top
R20  10K  [R0603]  65.31 12.05 90 top
SW1  TS-1088-AR02016  [SW-SMD_L3.9-W3.0-P4.45]  63.74 52.15 270 top
SW2  TS-1088-AR02016  [SW-SMD_L3.9-W3.0-P4.45]  57.01 52.28 270 top
U1  LESD5D5.0CT1G  [SOD-523_L1.2-W0.8-LS1.6-BI]  51.44 3.3 90 top
U2  LESD5D5.0CT1G  [SOD-523_L1.2-W0.8-LS1.6-BI]  43.94 10.29 270 top
U3  LESD5D5.0CT1G  [SOD-523_L1.2-W0.8-LS1.6-BI]  45.59 10.29 270 top
U4  AMS1117-3.3  [SOT-223-3_L6.5-W3.4-P2.30-LS7.0-BR]  45.04 22.14 270 top
U5  CP2102-GMR  [WQFN-28_L5.0-W5.0-P0.50-BL-EP3.2]  64.03 7.19 270 top
U6  ESP32-WROOM-32E-N4  [WIFI-SMD_ESP32-WROOM-32E]  58.93 32.39 180 top
U7  PCM5102APWR  [TSSOP-20_L6.5-W4.4-P0.65-LS6.4-BL]  29.38 44.6 270 top
U8  TPA6138A2PWR  [TSSOP-14_L5.0-W4.4-P0.65-LS6.4-BL]  10.8 43.69 0 top
U9  AP2337SA-7  [SOT-23-3_L2.9-W1.3-P1.90-LS2.4-BR]  54.53 13.8 90 top
USBC1  TYPE-C-31-M-12  [USB-C_SMD-TYPE-C-31-M-12]  45.59 3.81 0 top

## Footprints (pads in the part's own frame, mm; a bottom-side part is the same pattern mirrored in y, then rotated)
AUDIO-SMD_PJ-320D
  rect 3x1.4 smd: 1(-3,-4.05) 2(3,4.05) 3(3,1.05) 4(3,-2.95)
C0603
  rect 0.8x0.9 smd: 1(-0.7,0) 2(0.7,0)
CONN-TH_RCJ-013
  round 3.616 hole 2.605x2.6: 1(-2.25,0)
  round 3.6 hole 2.6: 1(2.25,5) 1(2.25,-5)
  round 2.55 hole 1.7: 2(2.25,0)
HDR-TH_2P-P2.54-V-M
  rect 2x2 hole 1.2: 1(-1.27,0)
  round 2 hole 1.2: 2(1.27,0)
HDR-TH_4P-P2.54-V-F
  rect 1.7x1.7 hole 1.1: 1(-3.81,0)
  round 1.7 hole 1.1: 2(-1.27,0) 3(1.27,0) 4(3.81,0)
LED0603-RD
  rect 0.8x0.8 smd: 1(-0.799,0) 2(0.799,0)
R0603
  rect 0.806x0.864 smd: 1(-0.753,0) 2(0.753,0)
SMA_L4.3-W2.5-LS5.0-RD
  rect 2x1.593 smd: 1(-2.1,0) 2(2.1,0)
SOD-523_L1.2-W0.8-LS1.6-BI
  rect 0.6x0.4 smd: 1(-0.75,0) 2(0.75,0)
SOT-23-3_L2.9-W1.3-P1.90-LS2.4-BR
  rect 1.25x0.7 smd: 1(1,-0.95) 2(1,0.95) 3(-1,0)
SOT-223-3_L6.5-W3.4-P2.30-LS7.0-BR
  rect 2.5x1.1 smd: 1(2.97,-2.3) 2(2.97,0) 3(2.97,2.3)
  rect 2.34x3.6 smd: 4(-2.97,0)
SW-SMD_L3.9-W3.0-P4.45
  rect 1.23x1.36 smd: 1(-2.185,0) 2(2.185,0)
TSSOP-14_L5.0-W4.4-P0.65-LS6.4-BL
  rect 0.4x1.7 smd: 1(-1.95,-2.8) 2(-1.3,-2.8) 3(-0.65,-2.8) 4(0,-2.8) 5(0.65,-2.8) 6(1.3,-2.8) 7(1.95,-2.8) 8(1.95,2.8) 9(1.3,2.8) 10(0.65,2.8) 11(0,2.8) 12(-0.65,2.8) 13(-1.3,2.8) 14(-1.95,2.8)
TSSOP-20_L6.5-W4.4-P0.65-LS6.4-BL
  oval 0.364x1.742 smd: 1(-2.925,-2.871) 2(-2.275,-2.871) 3(-1.625,-2.871) 4(-0.975,-2.871) 5(-0.325,-2.871) 6(0.325,-2.871) 7(0.975,-2.871) 8(1.625,-2.871) 9(2.275,-2.871) 10(2.925,-2.871) 11(2.925,2.871) 12(2.275,2.871) 13(1.625,2.871) 14(0.975,2.871) 15(0.325,2.871) 16(-0.325,2.871) 17(-0.975,2.871) 18(-1.625,2.871) 19(-2.275,2.871) 20(-2.925,2.871)
USB-C_SMD-TYPE-C-31-M-12
  oval 1.2x2 hole 0.8x1.6: 0(-4.325,1.706) 1(4.325,1.706)
  oval 1.2x1.8 hole 0.8x1.4: 2(4.325,-2.474) 3(-4.325,-2.474)
  rect 0.3x1.3 smd: A1(-3.35,2.474) A4(-2.55,2.474) A5(-1.25,2.474) A6(-0.25,2.474) A7(0.25,2.474) A8(1.25,2.474) A9(2.55,2.474) A12(3.35,2.474) B1(3.05,2.474) B4(2.25,2.474) B5(1.75,2.474) B6(0.75,2.474) B7(-0.75,2.474) B8(-1.75,2.474) B9(-2.25,2.474) B12(-3.05,2.474)
WIFI-SMD_ESP32-WROOM-32E
  rect 0.95x2.1 smd: 1(-9.002,-9) 2(-7.732,-9) 3(-6.463,-9) 4(-5.192,-9) 5(-3.922,-9) 6(-2.652,-9) 7(-1.383,-9) 8(-0.113,-9) 9(1.157,-9) 10(2.428,-9) 11(3.697,-9) 12(4.968,-9) 13(6.237,-9) 14(7.508,-9) 25(7.508,9) 26(6.237,9) 27(4.968,9) 28(3.697,9) 29(2.428,9) 30(1.157,9) 31(-0.113,9) 32(-1.383,9) 33(-2.652,9) 34(-3.922,9) 35(-5.192,9) 36(-6.463,9) 37(-7.732,9) 38(-9.002,9)
  rect 2.1x0.95 smd: 15(9.002,-5.715) 16(9.002,-4.445) 17(9.002,-3.175) 18(9.002,-1.905) 19(9.002,-0.635) 20(9.002,0.635) 21(9.002,1.905) 22(9.002,3.175) 23(9.002,4.445) 24(9.002,5.715)
  rect 0.9x0.9 smd: 39(-2.721,-0.1) 39(-2.721,-1.5) 39(-2.721,-2.9) 39(-1.321,-0.1) 39(-1.321,-1.5) 39(-1.321,-2.9) 39(0.079,-0.1) 39(0.079,-1.5) 39(0.079,-2.9)
WQFN-28_L5.0-W5.0-P0.50-BL-EP3.2
  oval 0.28x0.9 smd: 1(-1.502,-2.5) 2(-1.001,-2.5) 3(-0.5,-2.5) 4(0,-2.5) 5(0.5,-2.5) 6(1,-2.5) 7(1.501,-2.5) 15(1.501,2.5) 16(1,2.5) 17(0.5,2.5) 18(0,2.5) 19(-0.5,2.5) 20(-1.001,2.5) 21(-1.502,2.5)
  oval 0.9x0.28 smd: 8(2.5,-1.502) 9(2.5,-1.001) 10(2.5,-0.5) 11(2.5,0) 12(2.5,0.5) 13(2.5,1) 14(2.5,1.501) 22(-2.5,1.501) 23(-2.5,1) 24(-2.5,0.5) 25(-2.5,0) 26(-2.5,-0.5) 27(-2.5,-1.001) 28(-2.5,-1.502)
  rect 3.2x3.2 smd: 29(0,0)

## Nets
As in the schematic.

Pads without a net: U5 1 2 9 10 11 12 13 14 15 16 17 18 19 20 21 22 23 27 29; U6 4 5 6 7 8 9 12 13 14 16 17 18 19 20 21 22 23 24 26 28 29 30 31 32 33 37; U7 12; U8 5; USBC1 A8 B8

## Via types
v1: diameter 0.61, hole 0.305, Top Layer to Bottom Layer, 61 vias

## Routing (per net, layer and track width the routed paths; a pad name or vN(x,y) marks a point on that pad's centre or on a via; arc(x,y) is an arc through that point)
+5V: length 8
  Top Layer w0.254: C36.1 55.08,12.8 U9.3 54.53,11.5 52.36,9.34 C1.1
GND: length 123.6
  Top Layer w0.254: U6.39 U6.39 U6.39 U6.39 U6.39 U6.39 U6.39 U6.39 U6.39 58.45,35.69 v1(57.78,35.69) ; U8.4 10.8,39.12 12.06,37.85 v1(12.06,37.34) ; v1(12.78,48.2) 12.74,48.24 12.3,48.24 11.43,47.37 11.43,46.5 U8.10 ; C29.2 15.11,37.91 v1(15.11,37.72) ; v1(60.58,8.38) 60.81,8.16 60.81,8.02 61.05,7.77 61.45,7.77 U5.3 ; R2.1 47.5,10.2 v1(46.66,11.04) U3.1 U2.1 ; C18.2 C19.2 21.78,37.65 v1(21.72,37.59) ; C2.2 C3.2 47.58,15.45 v1(46.48,14.35) 46.16,14.35 C5.1 44.53,14.71 C4.1 ; v1(24.64,46.86) 25.18,46.86 25.82,46.23 U7.3 ; v1(23.11,52.45) 24.19,51.37 C25.2 24.32,51.18 C24.2 ; U6.15 48.13,38.1 v1(47.75,38.48) 45.09,38.48 H1.4 ; v1(58.93,55.12) 58.28,54.47 SW2.1 ; v1(3.56,38.61) 3.62,38.61 C31.2 ; U8.14 8.84,46.48 v1(7.87,46.48) ; USBC1.B1 USBC1.A12 49.15,6.28 USBC1.1 ; C36.2 57.26,13.48 v1(56.9,13.84) 55.94,14.8 U9.1 55.48,14.8 C37.2 ; C6.1 59.23,4.33 59.23,3.99 59.6,3.61 59.95,3.61 60.07,3.49 v1(60.07,2.92) 61.17,2.92 62.26,1.83 64.29,1.83 ; v1(68.58,47.24) 68.58,46.29 68.01,45.72 68.01,41.46 U6.1 ; v1(9.2,39.37) 8.85,39.72 U8.1 ; v1(16.38,45.97) 16.44,45.97 C26.1 17.59,46.86 17.59,45.09 17.72,44.96 C20.2 ; U7.19 33.99,46.88 C15.1 C14.1 37.53,47.56 v1(37.97,47.12) ; R17.1 13.83,54.87 v1(13.34,55.37) ; 30.84,48.92 30.84,50.76 30.8,50.8 C17.2 30.8,52.01 v1(30.1,52.71) ; 3.14,25.63 4.32,26.81 v1(4.32,27.18) ; C12.2 65.88,53.44 v1(65.88,54.18) 65.72,54.34 SW1.1 ; v1(33.59,44.83) 33.5,44.93 32.25,44.93 U7.17 ; C13.2 53.09,53.59 v1(52.71,53.59) ; U4.1 42.35,19.56 v1(41.02,19.56) 40.51,20.07 LED1.1 ; v1(11.3,17.4) 11.3,19.04 11.34,19.08 ; v1(27.18,41.02) 26.52,41.68 U7.10 U7.9 ; C1.2 51.44,6.92 v1(51.44,6.35) ; R1.2 41.41,8.12 v1(42.16,7.37) 42.24,7.29 USBC1.A1 USBC1.B12 ; U7.11 32.87,41.68 33.39,41.16 v1(33.59,41.16) ; v1(67.56,25.15) 67.93,24.78 U6.38 ; v1(51.94,1.91) 51.94,2.04 U1.1 ; v1(3.51,49.63) 3.51,50.91 C34.2 ; v1(16.38,49.53) 16.38,49.34 C28.2 ; C9.2 v1(60.83,43.82)
VCC: length 152.6
  Top Layer w0.254: U4.2 45.14,19.17 46.67,20.7 48,20.7 48.17,20.54 48.17,20.19 49.18,19.17 49.66,19.17 R7.2 ; U4.2 U4.4 ; U4.2 45.04,16.87 C5.2 44.53,16.11 C4.2 ; 27.66,46.7 27.66,43.41 27.23,42.98 U7.8 25.45,42.98 24.64,42.16 24.64,41.4 24.38,41.15 C18.1 C19.1 ; 27.66,46.7 27.66,47.14 27.28,47.53 U7.1 25.65,48.39 ; 27.66,46.7 31.1,43.26 ; 25.65,48.39 25.72,48.45 C24.1 25.59,49.66 C25.1 ; 25.65,48.39 16.68,48.39 15.95,47.66 14.92,47.66 14.19,48.39 C28.1 ; C28.1 14.03,49.28 13.83,49.47 R16.2 ; C28.1 13.99,48.39 13.22,47.62 12.43,47.62 12.09,47.28 U8.9 ; U4.4 44.7,25.44 44.7,26.84 ; U4.4 44.61,24.68 R3.2 ; 32.2,50.8 32.24,50.76 C16.1 32.24,47.54 U7.20 31.56,47.53 31.1,47.07 31.1,43.26 ; 31.1,43.26 31.1,40.44 44.7,26.84 ; 44.7,26.84 H1.1 44.07,31.88 v1(42.42,31.88) ; 44.7,26.84 46.1,25.44 ; R4.2 C11.1 C10.1 66.66,43.89 U6.2 ; R4.2 65.52,46.36 R5.2 ; R4.2 64.61,45.72 63.9,46.43 62.86,46.43 62.15,45.72 61.71,45.72 R6.2 v1(60.33,48.39)
  Bottom Layer w0.254: v1(60.33,48.39) 50.29,48.39 47.32,45.42 47.32,43.07 46.98,42.72 46.49,42.72 46.27,42.95 44.86,42.95 42.42,40.51 v1(42.42,31.88)
AMP_L: length 29
  Top Layer w0.254: R15.2 9.46,48.26 C35.1 9.71,48.39 ; 9.91,25.85 10.16,26.1 v1(10.16,27.56) ; U8.12 10.15,47.96 9.71,48.39 ; 9.71,48.39 v1(10.92,48.39)
  Bottom Layer w0.254: v1(10.92,48.39) 10.92,28.32 v1(10.16,27.56)
AMP_R: length 22.8
  Top Layer w0.254: U8.3 10.15,39.61 9.78,39.24 C32.1 9.07,38.17 R12.2 8.13,39.89 v1(8.13,40.77) ; 6.24,25.63 6.22,25.64 v1(6.22,27.43)
  Bottom Layer w0.254: v1(6.22,27.43) 8.13,29.34 v1(8.13,40.77)
BCK: length 24.8
  Top Layer w0.254: v1(34.16,42.93) 34.11,42.98 U7.13 ; v1(46.74,43.31) 54.74,43.31 55.23,42.81 U6.11
  Bottom Layer w0.254: v1(46.74,43.31) 34.54,43.31 v1(34.16,42.93)
CHIP_PU: length 54.8
  Top Layer w0.254: Q1.3 61.99,16.76 63.23,16.76 68.68,22.22 68.68,37.06 65.39,40.35 U6.3 65.39,43.26 C9.1 64.84,44.27 R4.1 63.03,45.36 61.57,45.36 59.25,47.68 58.25,47.68 R6.1 57.01,48.92 57.01,50.1 55.9,51.2 C13.1 52.69,51.2 48.9,54.99 H3.2
D+: length 23.4
  Top Layer w0.254: USBC1.A6 45.34,5.59 45.58,5.36 46.11,5.36 46.36,5.6 46.36,6.27 USBC1.B6 46.34,6.98 45.59,7.73 45.59,9.54 46.27,8.86 v1(46.27,8.35) ; v1(60.47,7.16) 61.5,7.16 U5.4
  Bottom Layer w0.254: v1(46.27,8.35) 59.28,8.35 v1(60.47,7.16)
D-: length 24.9
  Top Layer w0.254: v1(60.45,6.35) 60.79,6.35 61.05,6.61 61.45,6.61 U5.5 ; USBC1.B7 44.84,6.98 44.91,7.05 ; USBC1.A7 45.85,6.29 45.85,6.98 45.61,7.21 45.08,7.21 44.91,7.05 ; 44.22,9.26 44.91,8.57 44.91,7.05 ; 44.22,9.26 v1(44.22,7.99) ; 44.22,9.26 43.94,9.54
  Bottom Layer w0.254: v1(60.45,6.35) 59.42,7.39 46.03,7.39 45.43,7.99 v1(44.22,7.99)
DIN: length 42.2
  Top Layer w0.254: U7.14 45.15,43.63 49.92,38.85 51.09,38.85 65.41,24.54 65.41,23.4 U6.36
DTR: length 7.6
  Top Layer w0.254: 62.53,9.69 62.53,10.77 R19.1 62.13,11.45 63.43,12.75 63.43,14.22 Q2.3
GPIO0: length 78.7
  Top Layer w0.254: 48.26,52.45 48.26,53.18 46.98,54.46 46.98,55.52 47.73,56.27 51.66,56.27 55.48,52.45 57.48,52.45 v1(62.52,47.41) 63.29,47.41 R5.1 64.02,49.69 SW1.2 65.15,49.97 C12.1 ; v1(67.69,17.78) 67.69,17.43 Q2.2 ; U6.25 51.42,21.83 v1(51.31,21.72)
  Bottom Layer w0.254: v1(67.69,17.78) 64.64,20.83 ; 64.64,20.83 62.52,22.95 v1(62.52,47.41) ; 64.64,20.83 52.2,20.83 v1(51.31,21.72)
LINE_OUT_L: length 65.7
  Top Layer w0.254: v1(13.59,17.27) 13.46,17.15 13.46,14.77 J1.2 ; 19.3,45.09 21.34,45.09 21.73,44.7 ; 19.3,45.09 v1(20.19,45.97) ; 19.3,45.09 C21.1 ; v1(20.07,49.15) 20.07,52.45 15.94,56.58 C33.2
  Bottom Layer w0.254: v1(20.07,49.15) 20.19,49.02 v1(20.19,45.97) 13.59,39.37 v1(13.59,17.27)
LINE_OUT_R: length 54.2
  Top Layer w0.254: 21.73,43.18 C20.1 19.12,18.23 H2.1 17.34,15.11 J2.2 ; 19.12,38.29 11.1,30.27 9.89,30.27 C30.2
LRCK: length 26.4
  Top Layer w0.254: U6.10 56.5,43.07 55.48,44.09 33.51,44.09 33.32,44.28 U7.15
RTS: length 13.1
  Top Layer w0.254: Q1.2 64.17,15.99 64.17,16.33 64.33,16.49 65.81,16.49 65.97,16.33 65.97,15.4 65.81,15.24 64.94,15.24 64.6,14.89 64.6,12.29 64.76,12.13 65.3,12.13 65.31,12.11 R20.1 65.31,10.46 65.26,10.42 64.86,10.42 64.62,10.18 64.62,9.77 U5.24
USB_RX: length 40.1
  Top Layer w0.254: H1.2 48.51,29.97 48.51,26.16 48.76,25.92 62.24,25.92 64.12,24.03 U6.35 64.12,19.06 v1(64.11,19.05) ; v1(64.14,10.8) 64.03,10.7 U5.25
  Bottom Layer w0.254: v1(64.14,10.8) 64.11,10.82 v1(64.11,19.05)
USB_TX: length 38.1
  Top Layer w0.254: v1(61.59,25.15) 62.03,24.71 62.17,24.71 62.85,24.03 U6.34 62.85,19.16 v1(62.61,18.92) ; U5.26 63.53,11.14 v1(63.37,11.3) ; v1(46.86,35.81) 46.36,36.32 H1.3
  Bottom Layer w0.254: v1(46.86,35.81) 57.53,25.15 v1(61.59,25.15) ; v1(63.37,11.3) 63.37,18.16 v1(62.61,18.92)
$1N698: length 2.6
  Top Layer w0.254: R1.1 43.83,7.21 44.11,7.21 44.34,6.98 USBC1.A5
$1N818: length 1.9
  Top Layer w0.254: USBC1.B5 47.41,6.36 47.41,7.05 47.5,7.13 R2.2
$1N1017: length 13.7
  Top Layer w0.254: D1.2 51.49,4.05 U1.2 50.08,4.05 49.89,4.24 48.35,4.24 47.57,5.02 ; 47.57,5.02 48.01,5.45 48.01,6.12 USBC1.B4 USBC1.A9 ; 47.57,5.02 47.55,5 43.64,5 43.17,5.47 43.17,6.03 43.04,6.16 USBC1.A4
$1N2185: length 1.9
  Top Layer w0.254: R3.1 40.77,24.59 40.77,23.15 LED1.2
$1N2543: length 2.3
  Top Layer w0.254: 61.53,6.19 61.45,6.11 61.05,6.11 60.81,5.86 60.81,5.24 C6.2
$1N4373: length 4.5
  Top Layer w0.254: R7.1 52.06,21.49 52.63,22.06 53.28,22.06 53.44,22.22 53.44,22.87 U6.27
$1N4719: length 4.5
  Top Layer w0.254: U7.18 34.61,46.23 C15.2 C14.2
$1N5077: length 3.6
  Top Layer w0.254: U7.7 25.34,43.63 24.64,42.93 R8.2
$1N5228: length 3.3
  Top Layer w0.254: U7.6 23.41,44.28 R9.2
$1N5429: length 3.6
  Top Layer w0.254: C23.2 24.96,46.16 25.54,45.58 U7.4
$1N5435: length 3.7
  Top Layer w0.254: U7.2 25.77,46.88 25.08,47.56 C23.1
$1N5672: length 8.5
  Top Layer w0.254: C26.2 21.04,46.99 22.55,45.48 24.75,45.48 25.3,44.93 26.51,44.93
$1N6006: length 3
  Top Layer w0.254: C27.2 14.61,42.75 U8.7
$1N6011: length 2.7
  Top Layer w0.254: U8.8 14.61,44.63 C27.1
$1N6223: length 2.1
  Top Layer w0.254: U8.6 12.09,40.09 12.64,39.55 C29.1
$1N6630: length 1.5
  Top Layer w0.254: R10.1 9.78,31.94
$1N6710: length 7.4
  Top Layer w0.254: R12.1 6.23,37.79 C31.1 6.74,37.59 R11.1 8,35.43 8.52,34.92 R10.2
$1N6768: length 9.3
  Top Layer w0.254: U8.2 9.5,41.68 9.16,42.02 8.53,42.02 7.06,40.54 7.06,38.95 8,38 R11.2 8.71,37.84 C32.2
$1N7245: length 1.8
  Top Layer w0.254: R13.1 C33.1
$1N7247: length 6.9
  Top Layer w0.254: R13.2 8.25,51.56 6.87,51.56 R14.1 6.23,50.93 C34.1 5.6,50.22 R15.1
$1N7639: length 3.1
  Top Layer w0.254: R18.1 12.19,48.83 10.8,47.43 10.8,46.86
$1N7645: length 3.4
  Top Layer w0.254: R18.2 12.33,51.05 R16.1 R17.2
$1N7658: length 11.8
  Top Layer w0.254: R14.2 9.45,50.05 C35.2 8.77,48.96 7.63,48.96 7.62,48.97 6.58,48.97 6.42,48.81 6.42,47.71 6.58,47.55 7.62,47.55 7.79,47.71 9.07,47.71 9.53,47.25 9.53,46.52 U8.13
$1N19592: length 33.5
  Top Layer w0.254: U5.7 62.53,4.69 ; 62.53,4.69 62.53,3.5 C8.1 C7.1 ; 62.53,4.69 61.5,4.69 60.78,3.97 59.75,3.97 59.58,4.13 59.58,5.26 56.54,8.31 56.54,12.59 55.42,13.7 54.06,13.7 53.58,14.19 U9.2 ; U9.2 53.58,16.09 C37.1 ; U9.2 51.5,16.87 C2.1 C3.1 47.34,17.11 U4.3
$1N20296: length 2.5
  Top Layer w0.254: R19.2 62.13,13.39 Q1.1
$1N20339: length 2.8
  Top Layer w0.254: Q2.1 67.07,14.57 65.31,12.81

## Copper pours and planes (outline as drawn; the poured copper is in the pictures)
GND on Bottom Layer: 0,57.79 69.47,57.79 69.47,0 0,0
GND on Bottom Layer: 0,57.79 69.47,57.79 69.47,0 0,0

## Text on the board
Top Silkscreen Layer: VCC | Line / Left | Line / Right | by shuchir | GND | RX | TX | IO0 | EN | RESET | BOOT | Headphone / Out | bop
